# Altium schematic sheet MicroDial_Data_Log_V2.SchDoc: MicroDial_Data_Log_V2
size A3; Author: Burak DURU; Organization: DT INSU CNRS; Address1: 1, place Aristide Briand; Address2: 92195 Meudon Cedex; Address3: Tel: 01 45 07 50 50; Address4: FRANCE; DocumentNumber: 1; Revision: 2.0; SheetNumber: 1; SheetTotal: 4
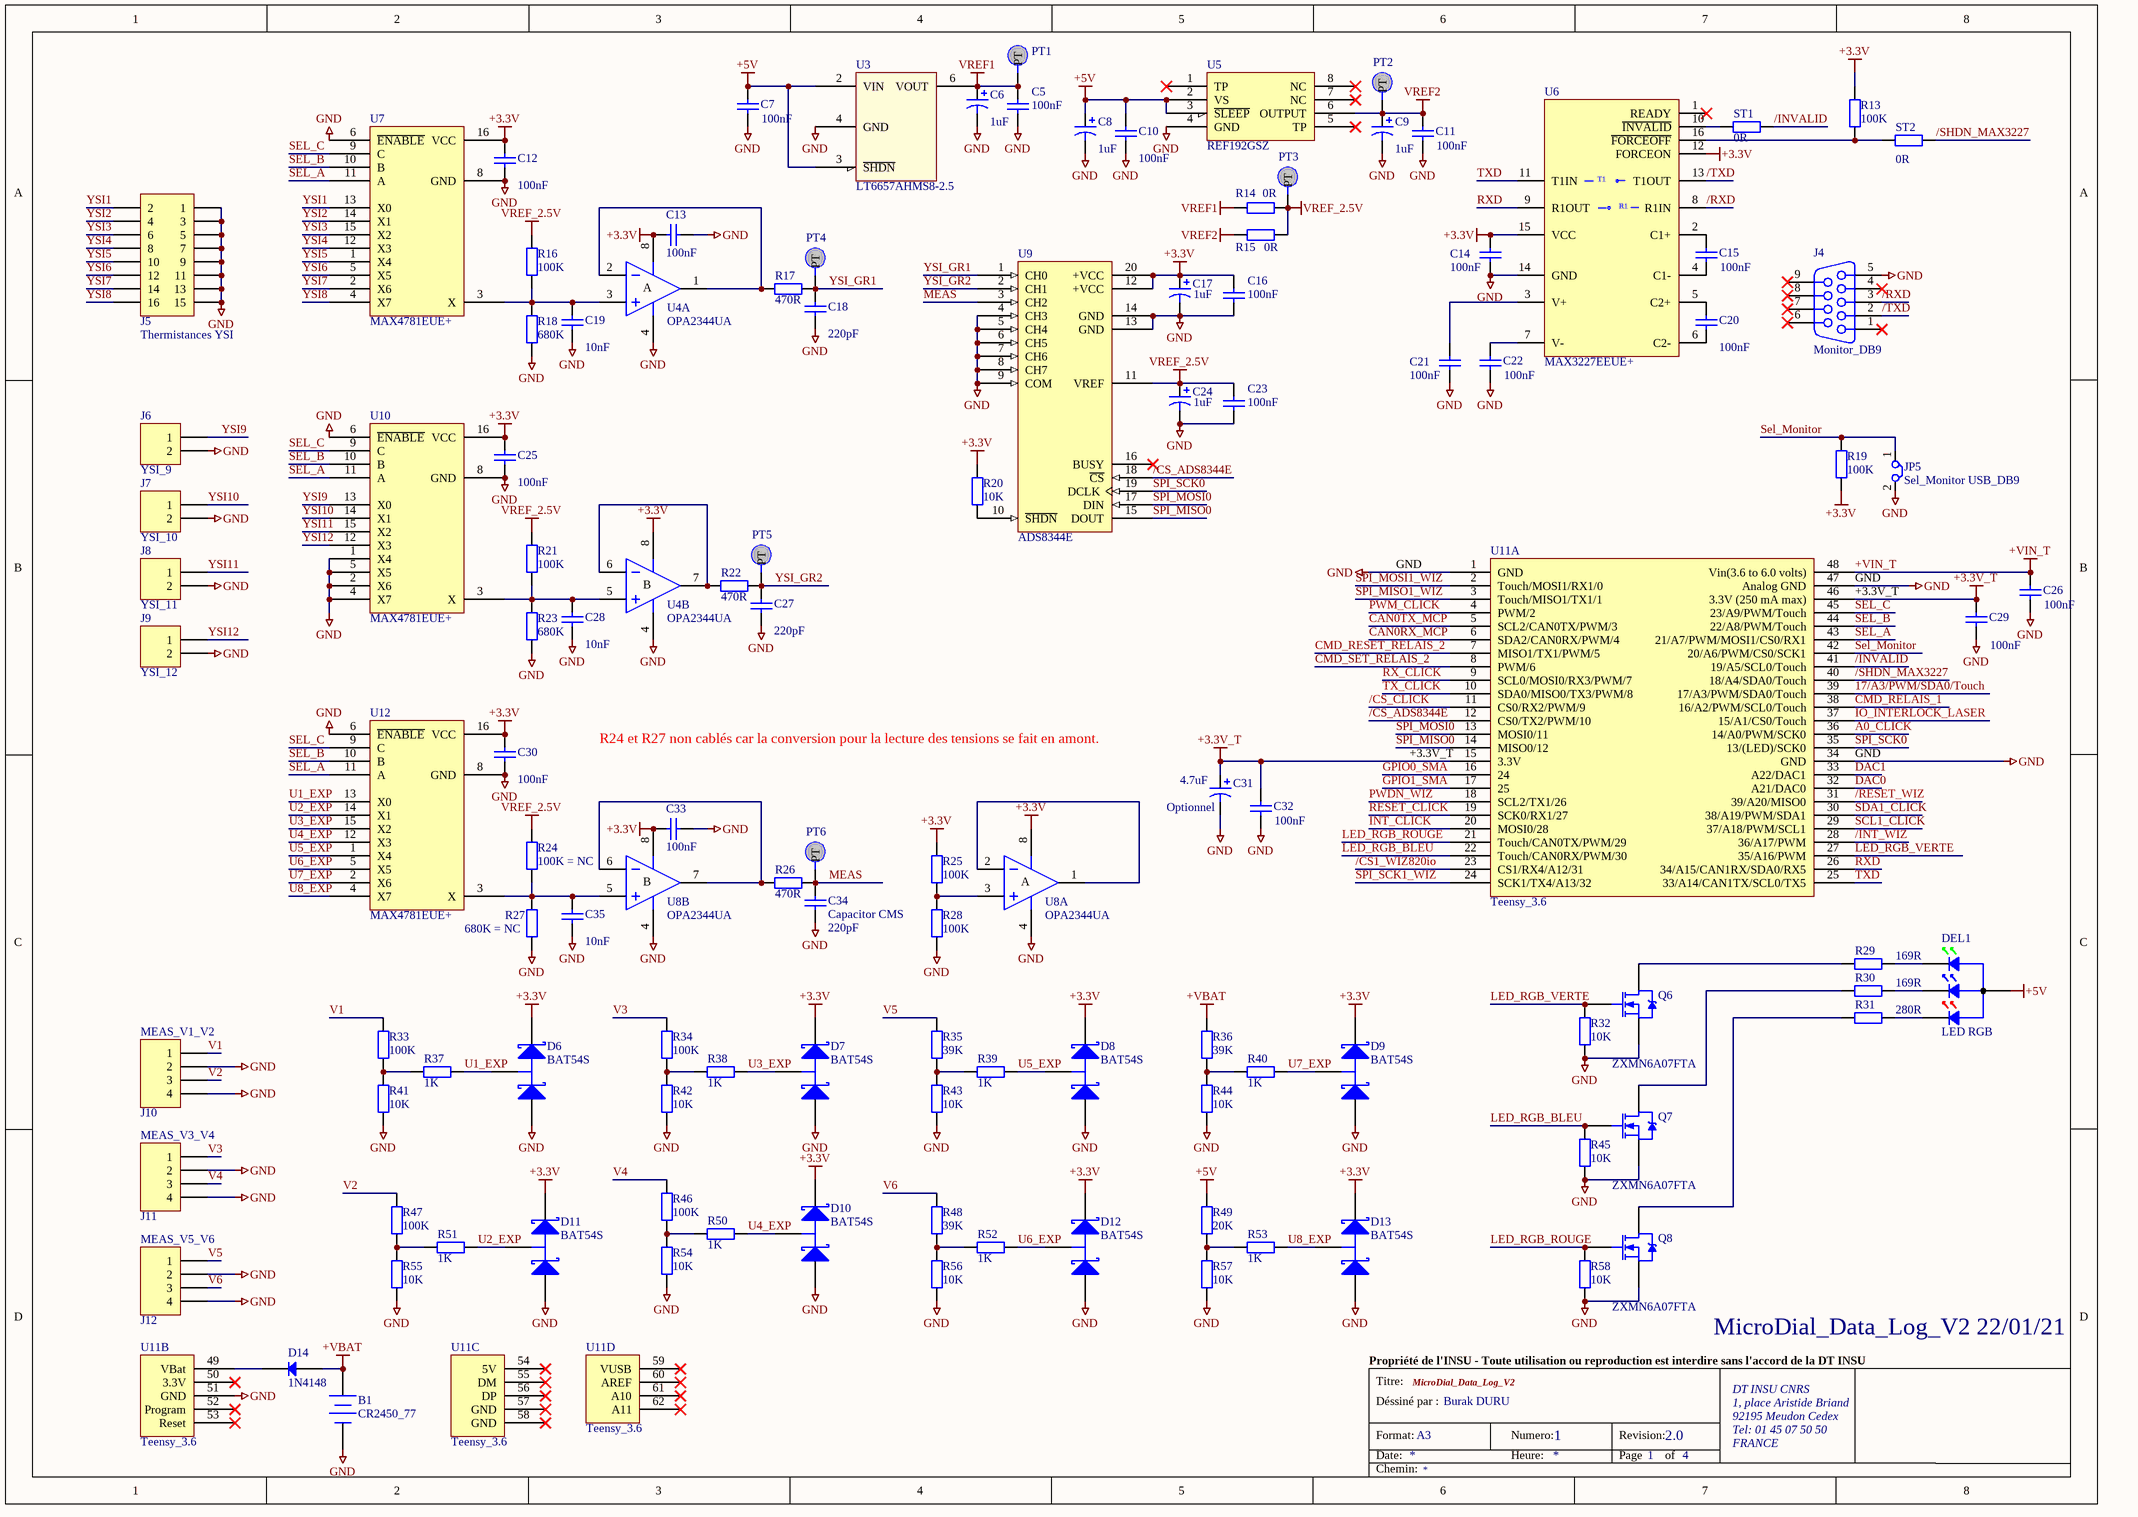
[diagram p0: MicroDial_Data_Log_V2.SchDoc]

## Parts
B1  CR2450_77  [Keystone-PN1025-7]
C5  value 100nF  [C603]  (hidden comment: Capacitor CMS)
C6  value 1uF  [CAPA-B]  (hidden comment: Polarized Capacitor Tantale)
C7  value 100nF  [C603]  (hidden comment: Capacitor CMS)
C8  value 1uF  [CAPA-B]  (hidden comment: Polarized Capacitor Tantale)
C9  value 1uF  [CAPA-B]  (hidden comment: Polarized Capacitor Tantale)
C10  value 100nF  [C603]  (hidden comment: Capacitor CMS)
C11  value 100nF  [C603]  (hidden comment: Capacitor CMS)
C12  value 100nF  [C603]  (hidden comment: Capacitor CMS)
C13  value 100nF  [C603]  (hidden comment: Capacitor CMS)
C14  value 100nF  [C603]  (hidden comment: Capacitor CMS)
C15  value 100nF  [C603]  (hidden comment: Capacitor CMS)
C16  value 100nF  [C603]  (hidden comment: Capacitor CMS)
C17  value 1uF  [CAPA-B]  (hidden comment: Polarized Capacitor Tantale)
C18  value 220pF  [C805]  (hidden comment: Capacitor CMS)
C19  value 10nF  [C603]  (hidden comment: Capacitor CMS)
C20  value 100nF  [C603]  (hidden comment: Capacitor CMS)
C21  value 100nF  [C603]  (hidden comment: Capacitor CMS)
C22  value 100nF  [C603]  (hidden comment: Capacitor CMS)
C23  value 100nF  [C603]  (hidden comment: Capacitor CMS)
C24  value 1uF  [CAPA-B]  (hidden comment: Polarized Capacitor Tantale)
C25  value 100nF  [C603]  (hidden comment: Capacitor CMS)
C26  value 100nF  [C603]  (hidden comment: Capacitor CMS)
C27  value 220pF  [C805]  (hidden comment: Capacitor CMS)
C28  value 10nF  [C603]  (hidden comment: Capacitor CMS)
C29  value 100nF  [C603]  (hidden comment: Capacitor CMS)
C30  value 100nF  [C603]  (hidden comment: Capacitor CMS)
C31  value 4.7uF  [CAPA-B]  (hidden comment: Polarized Capacitor Tantale)
C32  value 100nF  [C603]  (hidden comment: Capacitor CMS)
C33  value 100nF  [C603]  (hidden comment: Capacitor CMS)
C34  Capacitor CMS  value 220pF  [C805]
C35  value 10nF  [C603]  (hidden comment: Capacitor CMS)
D6  BAT54S  [SOT23 - SCHOTTKY]
D7  BAT54S  [SOT23 - SCHOTTKY]
D8  BAT54S  [SOT23 - SCHOTTKY]
D9  BAT54S  [SOT23 - SCHOTTKY]
D10  BAT54S  [SOT23 - SCHOTTKY]
D11  BAT54S  [SOT23 - SCHOTTKY]
D12  BAT54S  [SOT23 - SCHOTTKY]
D13  BAT54S  [SOT23 - SCHOTTKY]
D14  1N4148  [DO-35]
DEL1  LED RGB  [Kingbright WP154A4SEJ3VBDZGW/CA]
J4  Monitor_DB9  [CONEC 164A11519X]
J5  Thermistances YSI  [Molex 90130-3216]
J6  YSI_9  [Molex 90136-2202 - UPDATE]
J7  YSI_10  [Molex 90136-2202 - UPDATE]
J8  YSI_11  [Molex 90136-2202 - UPDATE]
J9  YSI_12  [Molex 90136-2202 - UPDATE]
J10  MEAS_V1_V2  [MKDS 1/4-3.81]
J11  MEAS_V3_V4  [MKDS 1/4-3.81]
J12  MEAS_V5_V6  [MKDS 1/4-3.81]
JP5  Sel_Monitor USB_DB9  [Molex 90120-0762]
PT1  Point Test  [PT]  (value not drawn)
PT2  Point Test  [PT]  (value not drawn)
PT3  Point Test  [PT]  (value not drawn)
PT4  Point Test  [PT]  (value not drawn)
PT5  Point Test  [PT]  (value not drawn)
PT6  Point Test  [PT]  (value not drawn)
Q6  ZXMN6A07FTA  [SOT23 - NMOSFET]
Q7  ZXMN6A07FTA  [SOT23 - NMOSFET]
Q8  ZXMN6A07FTA  [SOT23 - NMOSFET]
R13  value 100K  [R603]  (hidden comment: Res)
R14  value 0R  [R603]  (hidden comment: Res)
R15  value 0R  [R603]  (hidden comment: Res)
R16  value 100K  [MMA204]  (hidden comment: Res)
R17  value 470R  [R603]  (hidden comment: Res)
R18  value 680K  [MMA204]  (hidden comment: Res)
R19  value 100K  [R603]  (hidden comment: Res)
R20  value 10K  [R603]  (hidden comment: Res)
R21  value 100K  [MMA204]  (hidden comment: Res)
R22  value 470R  [R603]  (hidden comment: Res)
R23  value 680K  [MMA204]  (hidden comment: Res)
R24  value 100K = NC  [MMA204]  (hidden comment: Res)
R25  value 100K  [R603]  (hidden comment: Res)
R26  value 470R  [R603]  (hidden comment: Res)
R27  value 680K = NC  [MMA204]  (hidden comment: Res)
R28  value 100K  [R603]  (hidden comment: Res)
R29  value 169R  [R603]  (hidden comment: Res)
R30  value 169R  [R603]  (hidden comment: Res)
R31  value 280R  [R603]  (hidden comment: Res)
R32  value 10K  [R603]  (hidden comment: Res)
R33  value 100K  [MMA204]  (hidden comment: Res)
R34  value 100K  [MMA204]  (hidden comment: Res)
R35  value 39K  [MMA204]  (hidden comment: Res)
R36  value 39K  [MMA204]  (hidden comment: Res)
R37  value 1K  [R603]  (hidden comment: Res)
R38  value 1K  [R603]  (hidden comment: Res)
R39  value 1K  [R603]  (hidden comment: Res)
R40  value 1K  [R603]  (hidden comment: Res)
R41  value 10K  [MMA204]  (hidden comment: Res)
R42  value 10K  [MMA204]  (hidden comment: Res)
R43  value 10K  [MMA204]  (hidden comment: Res)
R44  value 10K  [MMA204]  (hidden comment: Res)
R45  value 10K  [R603]  (hidden comment: Res)
R46  value 100K  [MMA204]  (hidden comment: Res)
R47  value 100K  [MMA204]  (hidden comment: Res)
R48  value 39K  [MMA204]  (hidden comment: Res)
R49  value 20K  [MMA204]  (hidden comment: Res)
R50  value 1K  [R603]  (hidden comment: Res)
R51  value 1K  [R603]  (hidden comment: Res)
R52  value 1K  [R603]  (hidden comment: Res)
R53  value 1K  [R603]  (hidden comment: Res)
R54  value 10K  [MMA204]  (hidden comment: Res)
R55  value 10K  [MMA204]  (hidden comment: Res)
R56  value 10K  [MMA204]  (hidden comment: Res)
R57  value 10K  [MMA204]  (hidden comment: Res)
R58  value 10K  [R603]  (hidden comment: Res)
ST1  value 0R  [R603]  (hidden comment: Res)
ST2  value 0R  [R603]  (hidden comment: Res)
U3  LT6657AHMS8-2.5  [MSOP-8]
U4  OPA2344UA  [SOIC8N]  (parts A,B of 2)
U5  REF192GSZ  [SOIC8N]
U6  MAX3227EEUE+  [TSSOP-16 (U16-2)]
U7  MAX4781EUE+  [TSSOP-16]
U8  OPA2344UA  [SOIC8N]  (parts A,B of 2)
U9  ADS8344E  [QSOP20]
U10  MAX4781EUE+  [TSSOP-16]
U11  Teensy_3.6  [Teensy3_6]  (parts A,B,C,D of 4)
U12  MAX4781EUE+  [TSSOP-16]

## Nets
+3.3V: C12.1 C13.1 C14.1 C16.1 C17.1 C25.1 C30.1 C33.1 D6.2(K) D7.2(K) D8.2(K) D9.2(K) D10.2(K) D11.2(K) D12.2(K) D13.2(K) R13.1 R19.1 R20.2 R25.2 U4.8(V+) U6.12(FORCEON) U6.15(VCC) U7.16(VCC) U8.8(V+) U9.12(+VCC) U9.20(+VCC) U10.16(VCC) U12.16(VCC)
+3.3V_T: C29.1 C31.1 C32.1 U11.15(3.3V) U11.46(3.3V_(250_mA_max))
+5V: C7.1 C8.1 C10.1 DEL1.2(A_RGB) R49.2 U3.2(VIN) U3.3(~{SHDN}) U5.2(VS) U5.3(~{SLEEP})
+VBAT: B1.1(+) D14.1(A) R36.2
+VIN_T: C26.1 U11.48(Vin(3.6_to_6.0_volts))
GND: B1.2(-) C5.2 C6.2 C7.2 C8.2 C9.2 C10.2 C11.2 C12.2 C13.2 C14.2 C16.2 C17.2 C18.2 C19.2 C21.2 C22.2 C23.2 C24.2 C25.2 C26.2 C27.2 C28.2 C29.2 C30.2 C31.2 C32.2 C33.2 C34.2 C35.2 D6.3(A) D7.3(A) D8.3(A) D9.3(A) D10.3(A) D11.3(A) D12.3(A) D13.3(A) J4.5 J5.1 J5.3 J5.5 J5.7 J5.9 J5.11 J5.13 J5.15 J6.2 J7.2 J8.2 J9.2 J10.2 J10.4 J11.2 J11.4 J12.2 J12.4 JP5.2 Q6.3(S) Q7.3(S) Q8.3(S) R18.1 R23.1 R27.1 R28.1 R32.1 R41.1 R42.1 R43.1 R44.1 R45.1 R54.2 R55.1 R56.1 R57.1 R58.1 U3.4(GND) U4.4(V-) U5.4(GND) U6.14(GND) U7.6(~{ENABLE}) U7.8(GND) U8.4(V-) U9.4(CH3) U9.5(CH4) U9.6(CH5) U9.7(CH6) U9.8(CH7) U9.9(COM) U9.13(GND) U9.14(GND) U10.1(X4) U10.2(X6) U10.4(X7) U10.5(X5) U10.6(~{ENABLE}) U10.8(GND) U11.1(GND) U11.34(GND) U11.47(Analog_GND) U11.51(GND) U12.6(~{ENABLE}) U12.8(GND)
VREF1: C5.1 C6.1 PT1.1(PT) R14.1 U3.6(VOUT)
VREF2: C9.1 C11.1 PT2.1(PT) R15.1 U5.6(OUTPUT)
VREF_2.5V: C23.1 C24.1 PT3.1(PT) R14.2 R15.2 R16.2 R21.2 R24.2 U9.11(VREF)
17/A3/PWM/SDA0/Touch: U11.39(17/A3/PWM/SDA0/Touch)
/CS1_WIZ820io: U11.23(CS1/RX4/A12/31)
/CS_ADS8344E: U9.18(~{CS}) U11.12(CS0/TX2/PWM/10)
/CS_CLICK: U11.11(CS0/RX2/PWM/9)
/INT_WIZ: U11.28(36/A17/PWM)
/INVALID: ST1.1 U11.41(19/A5/SCL0/Touch)
/RESET_WIZ: U11.31(39/A20/MISO0)
/RXD: J4.3 U6.8(R1IN)
/SHDN_MAX3227: ST2.2 U11.40(18/A4/SDA0/Touch)
/TXD: J4.2 U6.13(T1OUT)
A0_CLICK: U11.36(14/A0/PWM/SCK0)
CAN0RX_MCP: U11.6(SDA2/CAN0RX/PWM/4)
CAN0TX_MCP: U11.5(SCL2/CAN0TX/PWM/3)
CMD_RELAIS_1: U11.38(16/A2/PWM/SCL0/Touch)
CMD_RESET_RELAIS_2: U11.7(MISO1/TX1/PWM/5)
CMD_SET_RELAIS_2: U11.8(PWM/6)
DAC0: U11.32(A21/DAC0)
DAC1: U11.33(A22/DAC1)
GPIO0_SMA: U11.16(24)
GPIO1_SMA: U11.17(25)
INT_CLICK: U11.20(MOSI0/28)
IO_INTERLOCK_LASER: U11.37(15/A1/CS0/Touch)
LED_RGB_BLEU: Q7.1(G) R45.2 U11.22(Touch/CAN0RX/PWM/30)
LED_RGB_ROUGE: Q8.1(G) R58.2 U11.21(Touch/CAN0TX/PWM/29)
LED_RGB_VERTE: Q6.1(G) R32.2 U11.27(35/A16/PWM)
MEAS: C34.1 PT6.1(PT) R26.1 U9.3(CH2)
PWDN_WIZ: U11.18(SCL2/TX1/26)
PWM_CLICK: U11.4(PWM/2)
RESET_CLICK: U11.19(SCK0/RX1/27)
RX_CLICK: U11.9(SCL0/MOSI0/RX3/PWM/7)
RXD: U6.9(R1OUT) U11.26(34/A15/CAN1RX/SDA0/RX5)
SCL1_CLICK: U11.29(37/A18/PWM/SCL1)
SDA1_CLICK: U11.30(38/A19/PWM/SDA1)
SEL_A: U7.11(A) U10.11(A) U11.43(21/A7/PWM/MOSI1/CS0/RX1) U12.11(A)
SEL_B: U7.10(B) U10.10(B) U11.44(22/A8/PWM/Touch) U12.10(B)
SEL_C: U7.9(C) U10.9(C) U11.45(23/A9/PWM/Touch) U12.9(C)
Sel_Monitor: JP5.1 R19.2 U11.42(20/A6/PWM/CS0/SCK1)
SPI_MISO0: U9.15(DOUT) U11.14(MISO0/12)
SPI_MISO1_WIZ: U11.3(Touch/MISO1/TX1/1)
SPI_MOSI0: U9.17(DIN) U11.13(MOSI0/11)
SPI_MOSI1_WIZ: U11.2(Touch/MOSI1/RX1/0)
SPI_SCK0: U9.19(DCLK) U11.35(13/(LED)/SCK0)
SPI_SCK1_WIZ: U11.24(SCK1/TX4/A13/32)
TX_CLICK: U11.10(SDA0/MISO0/TX3/PWM/8)
TXD: U6.11(T1IN) U11.25(33/A14/CAN1TX/SCL0/TX5)
U1_EXP: D6.1(C) R37.1 U12.13(X0)
U2_EXP: D11.1(C) R51.1 U12.14(X1)
U3_EXP: D7.1(C) R38.1 U12.15(X2)
U4_EXP: D10.1(C) R50.2 U12.12(X3)
U5_EXP: D8.1(C) R39.1 U12.1(X4)
U6_EXP: D12.1(C) R52.1 U12.5(X5)
U7_EXP: D9.1(C) R40.1 U12.2(X6)
U8_EXP: D13.1(C) R53.1 U12.4(X7)
V1: J10.1 R33.2
V2: J10.3 R47.2
V3: J11.1 R34.2
V4: J11.3 R46.2
V5: J12.1 R35.2
V6: J12.3 R48.2
YSI1: J5.2 U7.13(X0)
YSI2: J5.4 U7.14(X1)
YSI3: J5.6 U7.15(X2)
YSI4: J5.8 U7.12(X3)
YSI5: J5.10 U7.1(X4)
YSI6: J5.12 U7.5(X5)
YSI7: J5.14 U7.2(X6)
YSI8: J5.16 U7.4(X7)
YSI9: J6.1 U10.13(X0)
YSI10: J7.1 U10.14(X1)
YSI11: J8.1 U10.15(X2)
YSI12: J9.1 U10.12(X3)
YSI_GR1: C18.1 PT4.1(PT) R17.1 U9.1(CH0)
YSI_GR2: C27.1 PT5.1(PT) R22.1 U9.2(CH1)
NetC15_1: C15.1 U6.2(C1+)
NetC15_2: C15.2 U6.4(C1-)
NetC19_1: C19.1 R16.1 R18.2 U4.3(IN+) U7.3(X)
NetC20_1: C20.1 U6.5(C2+)
NetC20_2: C20.2 U6.6(C2-)
NetC21_1: C21.1 U6.3(V+)
NetC22_1: C22.1 U6.7(V-)
NetC28_1: C28.1 R21.1 R23.2 U4.5(IN+) U10.3(X)
NetC35_1: C35.1 R24.1 R27.2 U8.5(IN+) U12.3(X)
NetD14_2: D14.2(K) U11.49(VBat)
NetDEL1_1: DEL1.1(K_Red) R31.2
NetDEL1_3: DEL1.3(K_Blue) R30.2
NetDEL1_4: DEL1.4(K_Green) R29.2
NetQ6_2: Q6.2(D) R29.1
NetQ7_2: Q7.2(D) R30.1
NetQ8_2: Q8.2(D) R31.1
NetR13_2: R13.2 ST2.1 U6.16(~{FORCEOFF})
NetR17_2: R17.2 U4.1(OUT) U4.2(IN-)
NetR20_1: R20.1 U9.10(~{SHDN})
NetR22_2: R22.2 U4.6(IN-) U4.7(OUT)
NetR25_1: R25.1 R28.2 U8.3(IN+)
NetR26_2: R26.2 U8.6(IN-) U8.7(OUT)
NetR33_1: R33.1 R37.2 R41.2
NetR34_1: R34.1 R38.2 R42.2
NetR35_1: R35.1 R39.2 R43.2
NetR36_1: R36.1 R40.2 R44.2
NetR46_1: R46.1 R50.1 R54.1
NetR47_1: R47.1 R51.2 R55.2
NetR48_1: R48.1 R52.2 R56.2
NetR49_1: R49.1 R53.2 R57.2
NetST1_2: ST1.2 U6.10(~{INVALID})
NetU8_1: U8.1(OUT) U8.2(IN-)

Not connected (* = marked no-connect by the designer): J4 1* 4* 6* 7* 8* 9*; U3 1(DNC) 5(DNC) 7(DNC) 8(DNC); U5 1(TP)* 5(TP)* 7(NC)* 8(NC)*; U6 1(READY)*; U9 16(BUSY)*; U11 50(3.3V)* 52(Program)* 53(Reset)* 54(5V)* 55(DM)* 56(DP)* 57(GND)* 58(GND)* 59(VUSB)* 60(AREF)* 61(A10)* 62(A11)*

## Notes on the sheet
- R24 et R27 non cablés car la conversion pour la lecture des tensions se fait en amont.
- (near C31) Optionnel
- MicroDial_Data_Log_V2 22/01/21
- Propriété de l'INSU - Toute utilisation ou reproduction est interdire sans l'accord de la DT INSU
- Titre:
- Format:
- Date:
- Déssiné par :
- A3
- Numero:
- Heure:
- Revision:
- Page
- of
- Chemin:
- (in symbol MAX3227EEUE+) T1; R1
- (in symbol OPA2344, part A) A
- (in symbol OPA2344, part B) B

## Library data of the parts
B1 = Battery_CR2450_77: Coin CELL; Value: KEYSTONE 1025-7 + CR2477 ou 2450; Code Commande: F165-0668 + F521-9632
C5 C7 C10-C16 C20-C23 C25 C26 C29 C30 C32 C33 = Cap: 06035C104JAT2A - Condensateur céramique multicouche CMS, 0603 [1608 Metric], 0.1 µF, 50 V, ± 5%, X7R; Code Commande: F174-0621
C6 C8 C9 C17 C24 = Cap Tantale Pol: Polarized Capacitor Tantale Condensateur Tantale KEMET, 1μF, ±10%, 35 V,ESR 2Ω, CMS boitier B, série T494; Code Commande: RS538-2773 ou RS147-493
C18 C27 C34 = Cap: C0805C221K5RACTU - Condensateur céramique multicouche CMS, 0805 [2012 Metric], 220 pF, 50 V, ± 10%, X7R, Série C; Code Commande: F141-4680
C19 C28 C35 = Cap: 06035C103JAT2A - Condensateur céramique multicouche CMS, 0603 [1608 Metric], 0.01 µF, 50 V, ± 5%, X7R; Code Commande: F183-3871
C31 = Cap Tantale Pol: Polarized Capacitor Tantale TPSB475K035R0700 - Condensateur tantale CMS B, 4.7 µF, 35 V, Série TPS, ± 10%, 1210 [3225 Metric]; Code Commande: F165-8970
D6-D13 = BAT54S_News: Schottky Barrier Double Diode; Code Commande: F980-1510; Value: BAT54S
D14 = Diode: 1N4148 Diode signaux faibles, 100 V, 200 mA, 1 V, 4 ns, 4 A; Code Commande: F108-1177; Value: 1N4148
DEL1 = Kingbright WP154A4SEJ3VBDZGW/CA: Kingbright WP154A4SEJ3VBDZGW/CA T-1 3/4 (5mm) Full Color LED Lamp RGB; Code Commande: Mouser 604-WP154A43VBDZGWCA; Value: Kingbright WP154A4SEJ3VBDZGW/CA
J4 = CONEC 164A11519X: CI D-SUB9 FEMELLE 90°; Code Commande: Mouser 706-164A11519X /  DIGIKEY 164A11519X-ND; Value: CONEC 164A11519X
J5 = Molex 90130-3216: Molex 90130-3216 CGRID3 Double Rangée Coudé 16V; Code Commande: F973-4040; Value: Molex 90130-3216
J6-J9 = Molex 90136-2202: Molex 90136-2202 CGRID3 Simple Rangée Coudé 2V; Code Commande: RS 670-5376; Value: Molex 90136-2202
J10-J12 = PHOENIX CONTACT MKDS 1/4-3.81: PHOENIX CONTACT MKDS 1/4-3.81  SR 10V DROIT; Value: PHOENIX CONTACT MKDS 1/ 4-3,81 - 1727036; Code Commande: F370-4592
JP5 = Jump 12: Jumper 2 Wire; Value: Molex 90120-0762; Code Commande: F973-3302
PT1-PT6 = PT_1: Code Commande: F385-1564; Value: W HUGHES 300-3001
Q6-Q8 = ZXMN6A07FTA: 60V N-Channel ENHANCEMENT MODE MOSFET; Code Commande: Mouser 522-ZXMN6A07FTA ou F952-5769; Value: ZXMN6A07FTA
R13 R19 R25 R28 = Res: CRGP0603F100K Résistance à puce CMS, 100 kohm, ± 1%, 250 mW, 0603 [1608 Metric], Couche épaisse; Code Commande: F286-1058
R14 R15 ST1 ST2 = Res: MC0603WG00000T5E-TR -  Résistance à puce CMS, 0 ohm, 63 mW, 0603 [1608 Metric], Couche épaisse, Usage Général; Code Commande: F169-2453
R16 R21 R33 R34 R46 R47 = Res: MMA02040E1003BB100 - Résistance CMS MELF, 100 kohm, 200 V, 250 mW, ± 0.1%, Série MMA 0204, Couche métallique; Code Commande: F308-6422
R17 R22 R26 = Res: ERJPA3F4700V -  Résistance à puce CMS, Couche épaisse, 0603 [1608 Metric], 470 ohm, Série ERJPA3, 150 V; Code Commande: F233-5919
R18 R23 = Res: MMA0204MC6803FB300 -  Surface Mount MELF Resistor, 680 kohm, VISHAY - MMA 0204 HV Series, 500 V, Thin Film, 250 mW, ± 1%± 50ppm/K; Code Commande: F247-1794
R20 R32 R45 R58 = Res: WF06P1002FTL Résistance à puce CMS, 10 kohm, ± 1%, 125 mW, 0603 [1608 Metric], Couche épaisse, Haute puissance; Code Commande: F250-2802
R24 = Res: MMA02040E1003BB100 - Résistance CMS MELF, 100 kohm, 200 V, 250 mW, ± 0.1%, Série MMA 0204, Couche métallique; Code Commande: F308-6422 = NC
R27 = Res: MMA0204MC6803FB300 -  Surface Mount MELF Resistor, 680 kohm, VISHAY - MMA 0204 HV Series, 500 V, Thin Film, 250 mW, ± 1%± 50ppm/K; Code Commande: F247-1794 = NC
R29 R30 = Res: ERJPA3F1690V Résistance à puce CMS, Anti-surtensions, 169 ohm, ± 1%, 250 mW, 0603 [1608 Metric], Couche épaisse; Code Commande: F256-1819
R31 = Res: ERJPA3F2800V Résistance à puce CMS, Anti-surtensions, 280 ohm, ± 1%, 250 mW, 0603 [1608 Metric], Couche épaisse; Code Commande: F256-1932
R35 R36 R48 = Res: MMA02040E3902BB100 -  Résistance CMS MELF, 39 kohm, Série MMA 0204, 200 V, Couche métallique, 250 mW, ± 0.1%; Code Commande: F308-6320
R37-R40 R50-R53 = Res: ASC0603-1K0FT5 -  Résistance à puce CMS, Couche épaisse, 1 kohm, ± 1%, 100 mW, 0603 [1608 Metric], Couche épaisse; Code Commande: F207-8907
R41-R44 R54-R57 = Res: MMA02040E1002BB100 - Résistance CMS MELF, 10 kohm, 200 V, 250 mW, ± 0.1%, Série MMA 0204, Couche métallique; Code Commande: F308-6185
R49 = Res: MMA02040C2002FB300 Résistance CMS MELF, 20 kohm, MMA 0204 Series, 200 V, Couche mince, 250 mW, ± 1%; Code Commande: F261-4478
U3 = LT6657: LT6657AHMS8-2.5#PBF Référence de tension Series, AEC-Q100, Référence 2.5V, 1.5ppm/°C, MSOP-8; Code Commande: Digikey LT6657AHMS8-2.5#PBF-ND; Value: LT6657AHMS8-2.5#PBF-ND
U4 U8 = OPA2344: OPA2344UA Amplificateur opérationnel, 2 amplificateurs, 1 MHz, 0.8 V/µs, 2.5V à 5.5V, SOIC, 8 Broche(s); Code Commande: F311-7453; Value: OPA2344UA
U5 = REF192: Precision Micropower, Low Dropout  Voltage References; Code Commande: F960-5207; Value: REF192GSZ
U6 = MAX3227EEUE+: MAX3227EEUE+ -  Transceiver, RS232, Alimentation 3V-5.5V, 1 Driver, TSSOP-16; Code Commande: F251-1501; Value: MAX3227EEUE+
U7 U10 U12 = MAX4781EUE+: MULTIPLEXEUR ANALOG SIMPLE 8:1; Code Commande: F251-3726; Value: MAX4781EUE+
U9 = ADS8344E: 16-Bit, 8-Channel Serial Output Sampling  ANALOG-TO-DIGITAL CONVERTER; Code Commande: F300-4391; Value: ADS8344E
U11 = Teensy_3.6: 32Bit Arduino Compatible Microcontrolleur; Code Commande: Digikey 1568-1465-ND / Mouser 474-DEV-14058; Value: Teensy_3.6